# Altium schematic sheet LCD.SchDoc
size A4; SheetNumber: 5; SheetTotal: 15
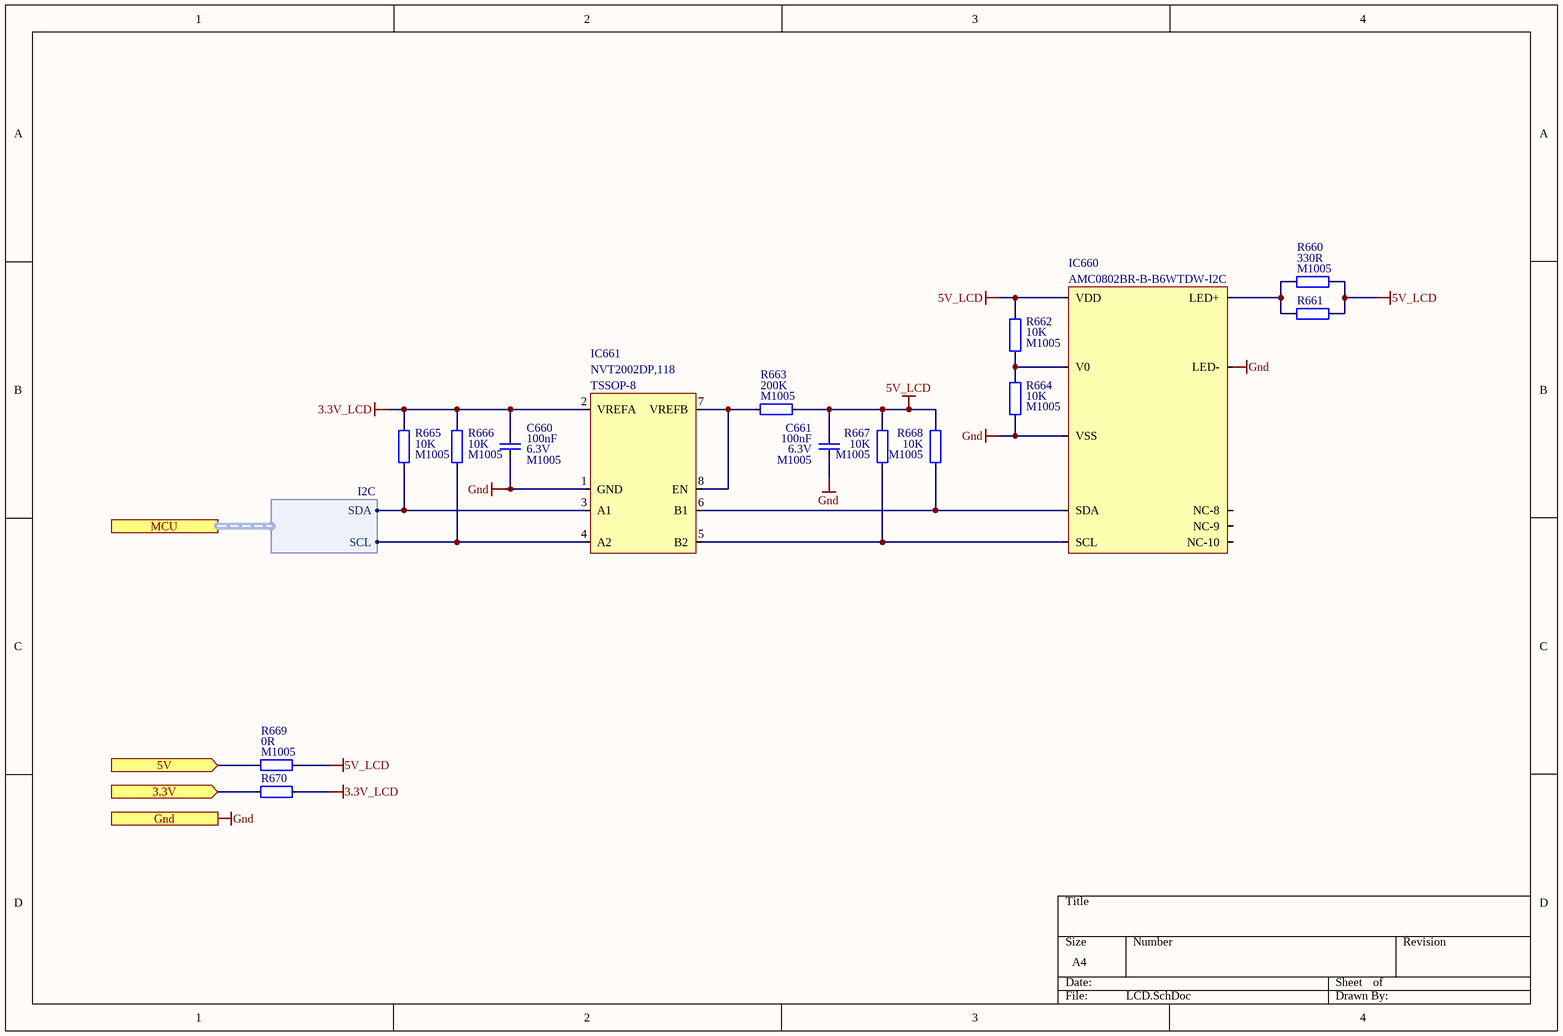
[diagram p0: LCD.SchDoc]

## Parts
C660  value 100nF  Voltage: 6.3V  Package: M1005  [Capacitor_Ceramic_M1005_I0402]  (hidden comment: Capacitor_Ceramic)
C661  value 100nF  Voltage: 6.3V  Package: M1005  [Capacitor_Ceramic_M1005_I0402]  (hidden comment: Capacitor_Ceramic)
IC660  Manufacturer Part Number: AMC0802BR-B-B6WTDW-I2C  [Orient, AMC0802BR-B-B6WTDW-I2C]  (hidden comment: Orient, AMC0802BR-B-B6WTDW-I2C)
IC661  Manufacturer Part Number: NVT2002DP,118  Package: TSSOP-8  [TSSOP-8, Body 3mm, Pitch 0.65mm]  (hidden comment: Voltage Translator, I2C - Nxp, NVT2002DP)
R660  value 330R  Package: M1005  [Resistor_Smd_M1005_I0402]  (hidden comment: Resistor)
R661  Resistor  [Resistor_Smd_M1005_I0402]  (value not drawn)
R662  value 10K  Package: M1005  [Resistor_Smd_M1005_I0402]  (hidden comment: Resistor)
R663  value 200K  Package: M1005  [Resistor_Smd_M1005_I0402]  (hidden comment: Resistor)
R664  value 10K  Package: M1005  [Resistor_Smd_M1005_I0402]  (hidden comment: Resistor)
R665  value 10K  Package: M1005  [Resistor_Smd_M1005_I0402]  (hidden comment: Resistor)
R666  value 10K  Package: M1005  [Resistor_Smd_M1005_I0402]  (hidden comment: Resistor)
R667  value 10K  Package: M1005  [Resistor_Smd_M1005_I0402]  (hidden comment: Resistor)
R668  value 10K  Package: M1005  [Resistor_Smd_M1005_I0402]  (hidden comment: Resistor)
R669  value 0R  Package: M1005  [Resistor_Smd_M1005_I0402]  (hidden comment: Resistor)
R670  Resistor  [Resistor_Smd_M1005_I0402]  (value not drawn)

## Ports
3.3V (in), 5V (in), Gnd (in), MCU (harness I2C)

## Harnesses
I2C: SDA, SCL

## Nets
3.3V_LCD: C660.1 IC661.2(VREFA) R665.1 R666.1 R670.2
5V_LCD: C661.1 IC660.VDD R660.2 R661.2 R662.1 R663.2 R667.1 R668.1 R669.2
Gnd: C660.2 C661.2 IC660.LED- IC660.VSS IC661.1(GND) R664.2 ; port Gnd
3.3V: R670.1 ; port 3.3V
5V: R669.1 ; port 5V
NetIC660_LED+: IC660.LED+ R660.1 R661.1
NetIC660_SCL: IC660.SCL IC661.5(B2) R667.2
NetIC660_SDA: IC660.SDA IC661.6(B1) R668.2
NetIC660_V0: IC660.V0 R662.2 R664.1
NetIC661_3: IC661.3(A1) R665.2 ; port MCU.SDA
NetIC661_4: IC661.4(A2) R666.2 ; port MCU.SCL
NetIC661_7: IC661.7(VREFB) IC661.8(EN) R663.1

Not connected (* = marked no-connect by the designer): IC660 NC-8 NC-9 NC-10

## Library data of the parts
C660 C661 = Capacitor_Ceramic: Cap, Cer, 100nF, 6.3V, M1005; Manufacturer Part Number: 04026D104KAT4A; Manufacturer: Kyocera; Temperature Coefficient: X5R; Tolerance: 10%; ComponentLink1Description: Datasheet; ComponentLink1URL: E:\Altium\Datasheets\Capacitor\Kyocera - X5R.pdf; ComponentLink2Description: Supplier Link; ComponentLink2URL: https://www.digikey.com/en/products/detail/kyocera-avx/04026D104KAT4A/8107673; Supplier: Digikey; Supplier Part Number: 478-11504-1-ND; Operating Temperature, Min: +85℃; Operating Temperature, Max: -55℃; Quantity, Min: 1; Quantity, Max: 250000; Price, Min: 0.1; Supplier Currency: $; Price, Max: 0.00189; Supplier Link: https://www.digikey.com/en/products/detail/kyocera-avx/04026D104KAT4A/8107673; Component Type: Ceramic; Component Category: Capacitor
IC660 = Orient, AMC0802BR-B-B6WTDW-I2C: Module, Display, Lcd, 2 Lines, I2C; Manufacturer: Orient Display; ComponentLink1Description: Datasheet; ComponentLink1URL: E:\Altium\Datasheets\Module - LCD\Orient, AMC0802BR-B-B6WTDW-I2C.pdf; ComponentLink2Description: Supplier Link; ComponentLink2URL: https://www.digikey.com/en/products/detail/orient-display/AMC0802BR-B-B6WTDW-I2C/12089222; Supplier: Digikey; Supplier Part Number: 3444-AMC0802BR-B-B6WTDW-I2C-ND; Operating Temperature, Min: -20℃; Operating Temperature, Max: +70℃; Quantity, Min: 1; Quantity, Max: 2000; Price, Min: 8.69; Supplier Currency: $; Price, Max: 4.21208; Supplier Link: https://www.digikey.com/en/products/detail/orient-display/AMC0802BR-B-B6WTDW-I2C/12089222; Component Type: LCD; Component Category: Module; Package: Custom
IC661 = Voltage Translator, I2C - Nxp, NVT2002DP: IC, Interface, I2C, TSSOP-8; ComponentLink1Description: Datasheet; ComponentLink1URL: E:\Altium\Datasheets\IC - Interface\Voltage Translator, I2C - Nxp, NVT2001, NVT2002.pdf; ComponentLink2Description: Supplier Link; ComponentLink2URL: https://www.digikey.com/en/products/detail/nxp-usa-inc/NVT2002DP-118/2355938; Supplier: Digikey; Supplier Part Number: 568-5121-1-ND; Manufacturer: Nxp; Operating Temperature, Min: -40℃; Operating Temperature, Max: +85℃; Quantity, Min: 1; Quantity, Max: 5000; Price, Min: 0.94; Supplier Currency: $; Price, Max: 0.35985; Supplier Link: https://www.digikey.com/en/products/detail/nxp-usa-inc/NVT2002DP-118/2355938; Component Type: Interface; Component Category: IC
R660 R661 = Resistor: Res, 330R, 1%, M1005; Manufacturer: Yageo; Manufacturer Part Number: RC0402FR-07330RL; Component Category: Resistor; Component Type: Fixed Value; Tolerance: 1%; Supplier Link: https://www.digikey.com/en/products/detail/yageo/RC0402FR-07330RL/726594; Supplier Currency: $; Price, Max: 0.00129; Price, Min: 0.1; Quantity, Max: 100000; Quantity, Min: 1; Operating Temperature, Max: -55℃; Operating Temperature, Min: +155℃; Supplier Part Number: 311-330LRCT-ND; Supplier: Digikey; ComponentLink1Description: Datasheet; ComponentLink1URL: E:\Altium\Datasheets\Resistor\Yageo - RC_L Series.pdf; ComponentLink2Description: Supplier Link; ComponentLink2URL: https://www.digikey.com/en/products/detail/yageo/RC0402FR-07330RL/726594
  R661: Value: 330R; Package: M1005
R662 R664-R668 = Resistor: Res, 10K, 1%, M1005; Manufacturer: Yageo; Manufacturer Part Number: RC0402FR-0710KP; Component Category: Resistor; Component Type: Fixed Value; Tolerance: 1%; Supplier Link: https://www.digikey.com/en/products/detail/yageo/RC0402FR-0710KP/4935264; Supplier Currency: $; Price, Max: 0.00282; Price, Min: 0.1; Quantity, Max: 100000; Quantity, Min: 1; Operating Temperature, Max: -55℃; Operating Temperature, Min: +155℃; Supplier Part Number: YAG1249CT-ND; Supplier: Digikey; ComponentLink1Description: Datasheet; ComponentLink1URL: E:\Altium\Datasheets\Resistor\Yageo - RC_L Series.pdf; ComponentLink2Description: Supplier Link; ComponentLink2URL: https://www.digikey.com/en/products/detail/yageo/RC0402FR-0710KP/4935264
R663 = Resistor: Res, 200K, 1%, M1005; Manufacturer: Yageo; Manufacturer Part Number: RC0402FR-07200KL; Component Category: Resistor; Component Type: Fixed Value; Tolerance: 1%; Supplier Link: https://www.digikey.com/en/products/detail/yageo/RC0402FR-07200KL/726558; Supplier Currency: $; Price, Max: 0.00129; Price, Min: 0.1; Quantity, Max: 100000; Quantity, Min: 1; Operating Temperature, Max: -55℃; Operating Temperature, Min: +155℃; Supplier Part Number: 311-200KLRCT-ND; Supplier: Digikey; ComponentLink1Description: Datasheet; ComponentLink1URL: E:\Altium\Datasheets\Resistor\Yageo - RC_L Series.pdf; ComponentLink2Description: Supplier Link; ComponentLink2URL: https://www.digikey.com/en/products/detail/yageo/RC0402FR-07200KL/726558
R669 R670 = Resistor: Res, 0R, M1005; Manufacturer: Yageo; Manufacturer Part Number: RC0402FR-070RL; Component Category: Resistor; Component Type: Fixed Value; Tolerance: *; Supplier Link: https://www.digikey.com/en/products/detail/yageo/RC0402FR-070RL/2827570; Supplier Currency: $; Price, Max: 0.00109; Price, Min: 0.1; Quantity, Max: 50000; Quantity, Min: 1; Operating Temperature, Max: -55℃; Operating Temperature, Min: +155℃; Supplier Part Number: 311-0.0LRCT-ND; Supplier: Digikey; ComponentLink1Description: Datasheet; ComponentLink1URL: E:\Altium\Datasheets\Resistor\Yageo - RC_L Series.pdf; ComponentLink2Description: Supplier Link; ComponentLink2URL: https://www.digikey.com/en/products/detail/yageo/RC0402FR-070RL/2827570
  R670: Value: 0R; Package: M1005